# EAGLE design S2ER13 (EAGLE 7.5.0)
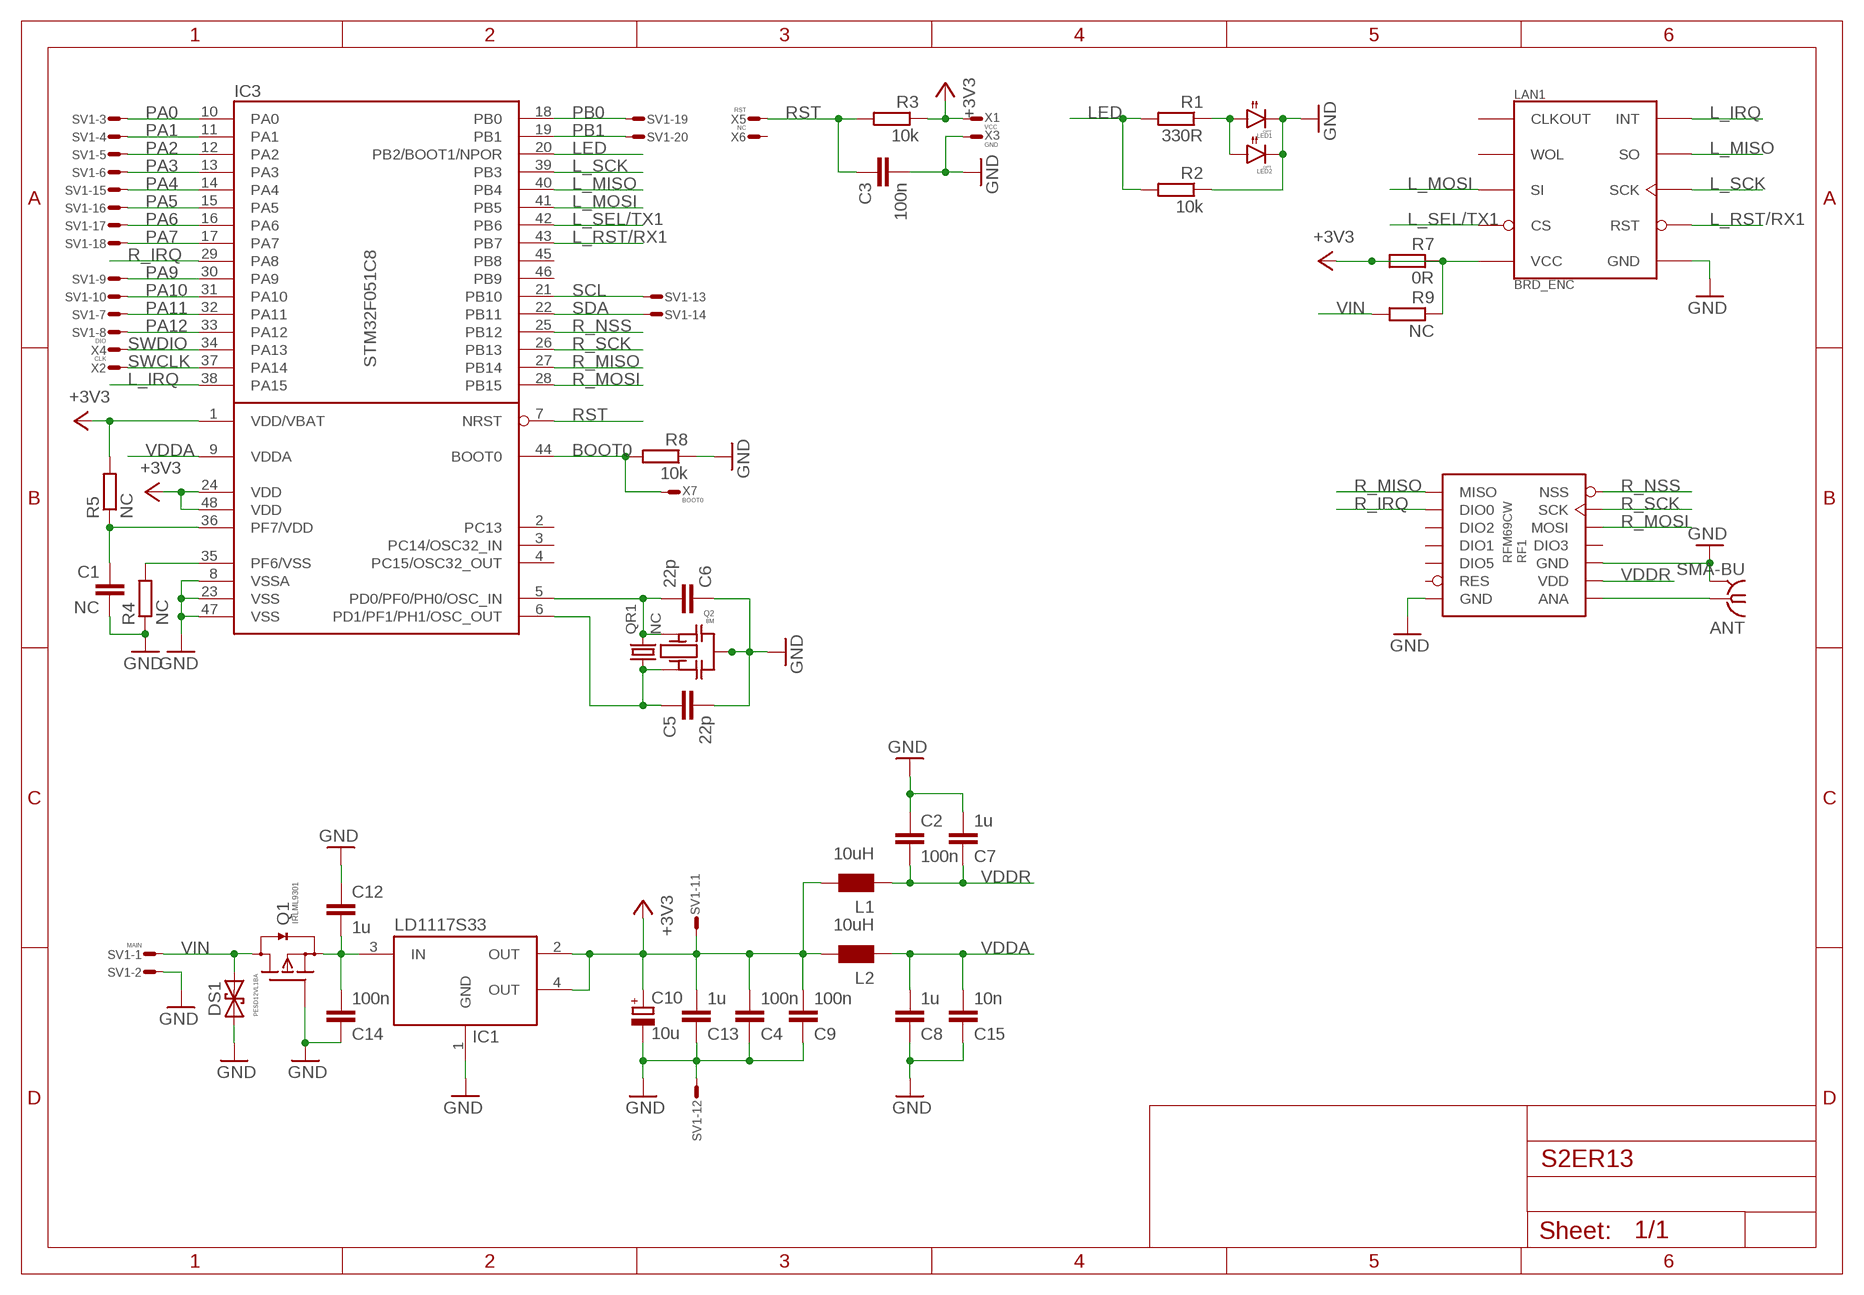
[diagram p0: schematic, sheet 1]

## Parts
ANT  SMA-BU  [BU-SMA-V]
C1  NC  C0603  [0603]
C2  100n  C0603  [0603]
C3  100n  C0603  [0603]
C4  100n  C0603  [0603]
C5  22p  C0603  [0603]
C6  22p  C0603  [0603]
C7  1u  C0603  [0603]
C8  1u  C0603  [0603]
C9  100n  C0603  [0603]
C10  10u  C_POLSMCA  [SMC_A]
C12  1u  C0603  [0603]
C13  1u  C0603  [0603]
C14  100n  C0603  [0603]
C15  10n  C0603  [0603]
DS1  PESD12VL1BA  TVS-U323  [SOD323]
IC1  LD1117S33  LDO_4P  [SOT223]
IC3  STM32F051C8  STM32_LQFP48  [LQFP48]
L1  10uH  L0603  [0603]
L2  10uH  L0603  [0603]
LAN1  BRD_ENC  [BRD_ENC]
LED1  OPT  LEDT134  [T1-3/4]
LED2  OPT  LED1206  [1206]
Q1  IRLML9301  FET-PDSOT23  [SOT23]
Q2  8M  QRCE  [CSTCE]
QR1  NC  QABS07  [ABS07]
R1  330R  R0603  [0603]
R2  10k  R0603  [0603]
R3  10k  R0603  [0603]
R4  NC  R0603  [0603]
R5  NC  R0603  [0603]
R7  0R  R0603  [0603]
R8  10k  R0603  [0603]
R9  NC  R0603  [0603]
RF1  RFM69CW  RFM69CW-868-S1  [RFM69CW]
SV1  MAIN  ML20LSE  [ML20LS]
X1  VCC  WIREPADT1.6/0.9  [T1.6/0.9]
X2  CLK  WIREPADT1.6/0.9  [T1.6/0.9]
X3  GND  WIREPADT1.6/0.9  [T1.6/0.9]
X4  DIO  WIREPADT1.6/0.9  [T1.6/0.9]
X5  RST  WIREPADT1.6/0.9  [T1.6/0.9]
X6  NC  WIREPADT1.6/0.9  [T1.6/0.9]
X7  BOOT0  WIREPADT1.6/0.9  [T1.6/0.9]

## Nets
+3V3: C4.2 C9.2 C10.+ C13.2 IC1.2(OUT) IC1.4(OUT) IC3.1(VDD/VBAT) IC3.24(VDD) IC3.48(VDD) L1.2 L2.2 LAN1.P$9(VCC) R3.1 R5.2 R7.1 R7.2 R9.1 SV1.P$11 X1.1(S)
BOOT0: IC3.44(BOOT0) R8.2 X7.1(S)
GND: ANT.2 ANT.3 ANT.4 ANT.5 C1.2 C2.1 C3.2 C4.1 C5.2 C6.1 C7.2 C8.1 C9.1 C10.- C12.1 C13.1 C14.1 C15.1 DS1.A IC1.1(GND) IC3.8(VSSA) IC3.23(VSS) IC3.47(VSS) LAN1.P$10(GND) LED1.C LED2.2(C) Q1.1(G) Q2.G(M) R2.1 R4.1 R8.1 RF1.GND@3(GND) RF1.GND@14(GND) SV1.P$2 SV1.P$12 X3.1(S)
L_IRQ: IC3.38(PA15) LAN1.P$2(INT)
L_MISO: IC3.40(PB4) LAN1.P$4(SO)
L_MOSI: IC3.41(PB5) LAN1.P$5(SI)
L_RST/RX1: IC3.43(PB7) LAN1.P$8(RST)
L_SCK: IC3.39(PB3) LAN1.P$6(SCK)
L_SEL/TX1: IC3.42(PB6) LAN1.P$7(CS)
LED: IC3.20(PB2/BOOT1/NPOR) R1.2 R2.2
N$1: LED1.A LED2.1(A) R1.1
N$2: IC3.35(PF6/VSS) R4.2
N$3: C1.1 IC3.36(PF7/VDD) R5.1
N$5: ANT.1 RF1.ANA
N$20: C6.2 IC3.5(PD0/PF0/PH0/OSC_IN) Q2.A QR1.P$2
N$21: C5.1 IC3.6(PD1/PF1/PH1/OSC_OUT) Q2.B QR1.P$1
N$31: C12.2 C14.2 IC1.3(IN) Q1.2(S)
PA0: IC3.10(PA0) SV1.P$3
PA1: IC3.11(PA1) SV1.P$4
PA2: IC3.12(PA2) SV1.P$5
PA3: IC3.13(PA3) SV1.P$6
PA4: IC3.14(PA4) SV1.P$15
PA5: IC3.15(PA5) SV1.P$16
PA6: IC3.16(PA6) SV1.P$17
PA7: IC3.17(PA7) SV1.P$18
PA9: IC3.30(PA9) SV1.P$9
PA10: IC3.31(PA10) SV1.P$10
PA11: IC3.32(PA11) SV1.P$7
PA12: IC3.33(PA12) SV1.P$8
PB0: IC3.18(PB0) SV1.P$19
PB1: IC3.19(PB1) SV1.P$20
R_IRQ: IC3.29(PA8) RF1.DIO0
R_MISO: IC3.27(PB14) RF1.MISO
R_MOSI: IC3.28(PB15) RF1.MOSI
R_NSS: IC3.25(PB12) RF1.NSS
R_SCK: IC3.26(PB13) RF1.SCK
RST: C3.1 IC3.7(NRST) R3.2 X5.1(S)
SCL: IC3.21(PB10) SV1.P$13
SDA: IC3.22(PB11) SV1.P$14
SWCLK: IC3.37(PA14) X2.1(S)
SWDIO: IC3.34(PA13) X4.1(S)
VDDA: C8.2 C15.2 IC3.9(VDDA) L2.1
VDDR: C2.2 C7.1 L1.1 RF1.VDD
VIN: DS1.C Q1.3(D) R9.2 SV1.P$1
Unconnected: IC3.2(PC13) IC3.3(PC14/OSC32_IN) IC3.4(PC15/OSC32_OUT) IC3.45(PB8) IC3.46(PB9) LAN1.P$1(CLKOUT) LAN1.P$3(WOL) RF1./RES(RES) RF1.DIO1 RF1.DIO2 RF1.DIO3 RF1.DIO5 X6.1(S)

## Library data of the parts
ANT = Conn:SMA-: SMA 50 Ohm End Launch Jack Receptacle - Round Contact Johnson Components Source: www.johnsoncomponents.com .. J502-ND.pdf
C1-C9 C12-C15 = RCL:C: Capacitor SMD
C10 = RCL:C_POL: POLARIZED CAPACITOR, European symbol
DS1 = Diode:TVS-U: DIODE
IC1 = DCDC:LDO_4P
IC3 = STM32:STM32_LQFP48
L1 L2 = RCL:L
LAN1 = brd_enc:BRD_ENC
LED1 LED2 = Optic:LED
Q1 = Transistor:FET-PD
Q2 = QUARTZ:QR
QR1 = QUARTZ:Q
R1-R5 R7-R9 = RCL:R: Resistor SMD
RF1 = RF:RFM69CW: 5dB Transceiver Module
SV1 = Conn:ML20?E: HARTING
X1-X7 = Conn:WIREPAD: Wire PAD connect wire on PCB

## Board
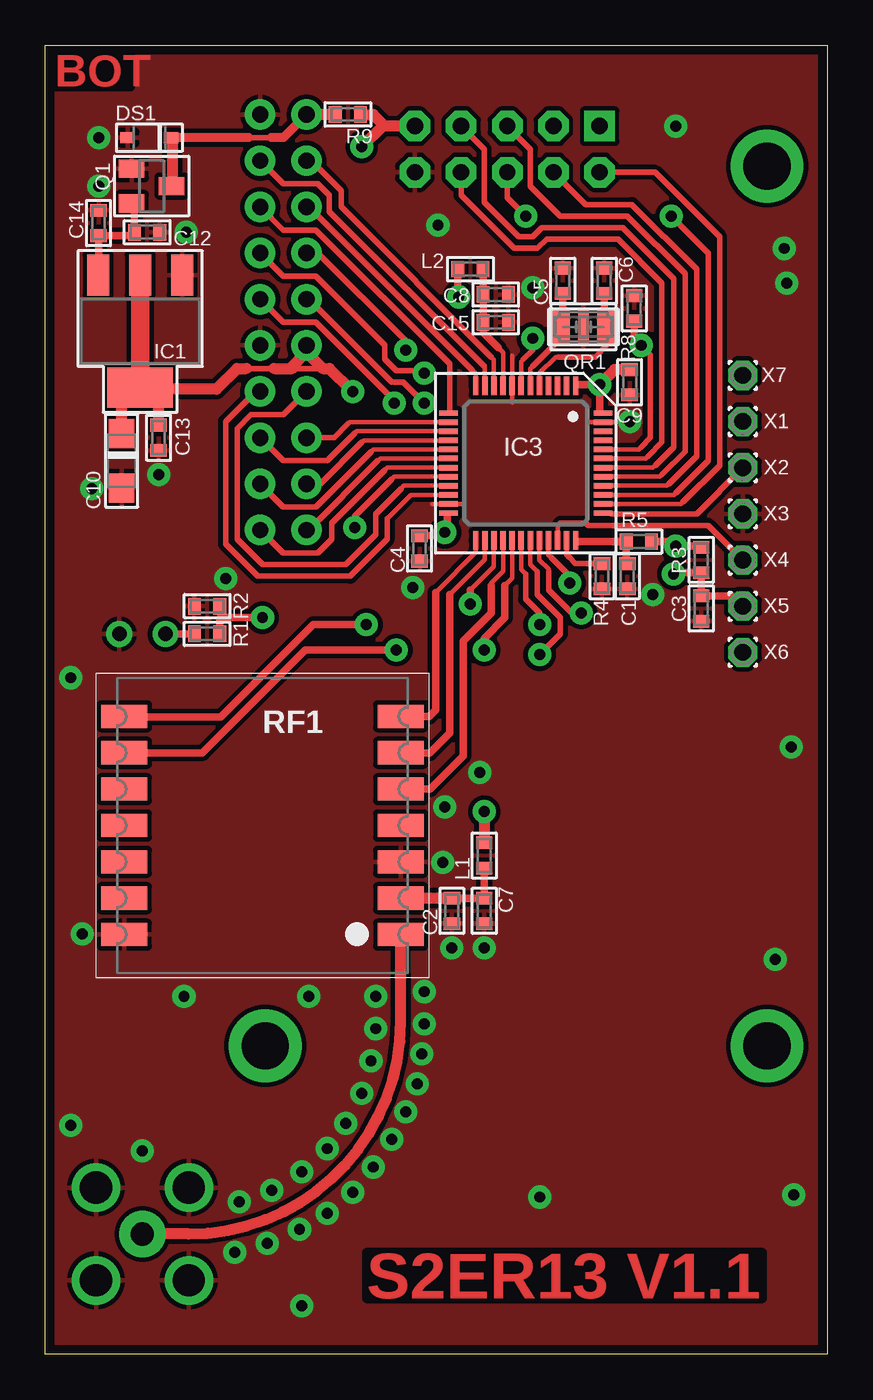
[diagram p1: board, top side]
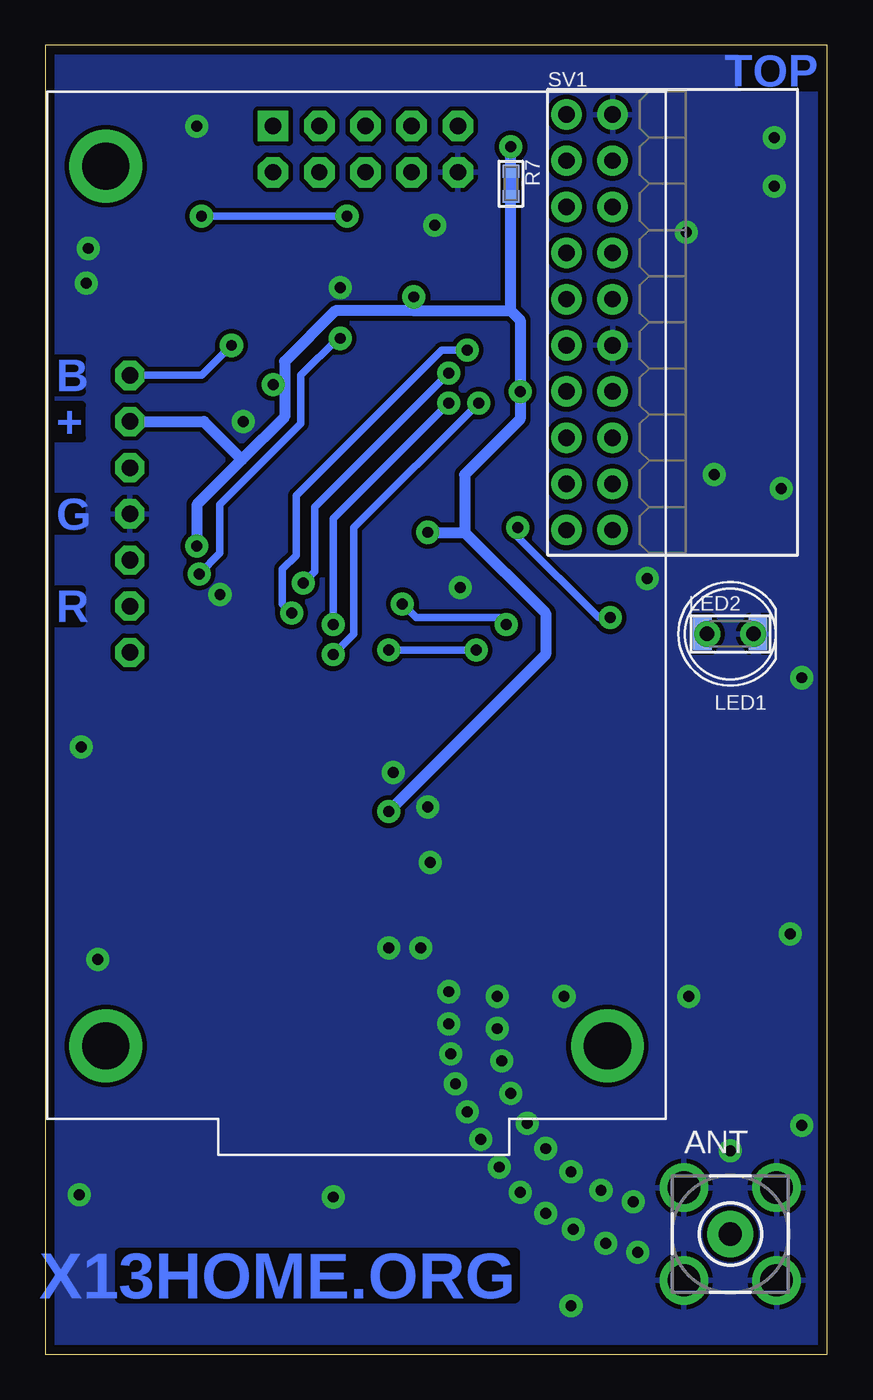
[diagram p2: board, bottom side, seen from below]

Size 43 x 72 mm. Coordinates in mm from the lower left corner, seen from the top.
Outline: 43,0 0,0 0,72 43,72 43,0
Copper layers (1*16): Top 0.035mm / dielectric 1.5mm / Bottom 0.035mm
Design rules "default *": minimum track width 10mil, minimum drill 0.5mm, track to track 10mil, track to pad 10mil, pad to pad 6mil, via to via 10mil, smd to smd 6mil, copper to edge 20mil, drill to drill 8mil, minimum pad ring 10mil, minimum via ring 8mil, stop-mask expansion 2mil, vias tented up to drill 25mil, thermal gap 10mil
tKeepout: area 0,0 to 43,2.5; area 0,69.5 to 43,72
bKeepout: area 0,0 to 43,1.3; area 0,70.7 to 43,72

### Footprints (pad centres in the part's own frame; a part is rotated, then mirrored left to right if it is on the bottom)
BU-SMA-V = drill 1.27 pad 2.54: 1 0,0 | drill 1.778: 2 -2.55,2.55; 3 2.55,2.55; 4 2.55,-2.55; 5 -2.55,-2.55
0603 = smd 0.7 x 0.9: 1 -0.697,0; 2 0.697,0
SMC_A = smd 1.6 x 1.4: + -1.5,0; - 1.5,0
SOD323 = smd 0.8 x 0.6: A 1.2,0; C -1.2,0
SOT223 = smd 1.219 x 2.235: 1 -2.311,-3.099; 2 0,-3.099; 3 2.311,-3.099 | smd 3.6 x 2.2: 4 0,3.099
LQFP48 = smd 0.3 x 1: 1 -2.75,-4.25; 2 -2.25,-4.25; 3 -1.75,-4.25; 4 -1.25,-4.25; 5 -0.75,-4.25; 6 -0.25,-4.25; 7 0.25,-4.25; 8 0.75,-4.25; 9 1.25,-4.25; 10 1.75,-4.25; 11 2.25,-4.25; 12 2.75,-4.25; 25 2.75,4.25; 26 2.25,4.25; 27 1.75,4.25; 28 1.25,4.25; 29 0.75,4.25; 30 0.25,4.25; 31 -0.25,4.25; 32 -0.75,4.25; 33 -1.25,4.25; 34 -1.75,4.25; 35 -2.25,4.25; 36 -2.75,4.25 | smd 1 x 0.3: 13 4.25,-2.75; 14 4.25,-2.25; 15 4.25,-1.75; 16 4.25,-1.25; 17 4.25,-0.75; 18 4.25,-0.25; 19 4.25,0.25; 20 4.25,0.75; 21 4.25,1.25; 22 4.25,1.75; 23 4.25,2.25; 24 4.25,2.75; 37 -4.25,2.75; 38 -4.25,2.25; 39 -4.25,1.75; 40 -4.25,1.25; 41 -4.25,0.75; 42 -4.25,0.25; 43 -4.25,-0.25; 44 -4.25,-0.75; 45 -4.25,-1.25; 46 -4.25,-1.75; 47 -4.25,-2.25; 48 -4.25,-2.75
BRD_ENC = drill 0.9 pad 1.676 square: P$1 21.59,54.61 | drill 0.9 pad 1.676 octagon: P$2 21.59,52.07; P$3 19.05,54.61; P$4 19.05,52.07; P$5 16.51,54.61; P$6 16.51,52.07; P$7 13.97,54.61; P$8 13.97,52.07; P$9 11.43,54.61; P$10 11.43,52.07 | drill 2.6 pad 4: PAD@1 3.2,4; PAD@2 30.8,4; PAD@3 30.8,52.4
T1-3/4 = drill 0.8 pad 1.422: A 1.27,0; C -1.27,0
1206 = smd 1.016 x 1.778: 1 -1.524,0; 2 1.524,0
SOT23 = smd 1 x 1.4: 1 -0.95,-1.1; 2 0.95,-1.1; 3 0,1.1
CSTCE = smd 0.6 x 2: A -1.2,0; B 1.2,0; G 0,0
ABS07 = smd 1 x 1.8: P$1 -1.25,0; P$2 1.25,0
RFM69CW = smd 2.54 x 1.27: /RES -7.6,-4; ANA 7.6,-6; DIO0 -7.6,4; DIO1 -7.6,0; DIO2 -7.6,2; DIO3 7.6,0; DIO5 -7.6,-2; GND@3 7.6,-2; GND@14 -7.6,-6; MISO -7.6,6; MOSI 7.6,2; NSS 7.6,6; SCK 7.6,4; VDD 7.6,-4
ML20LS = drill 0.9 pad 1.676: P$1 -11.43,-1.27; P$2 -11.43,1.27; P$3 -8.89,-1.27; P$4 -8.89,1.27; P$5 -6.35,-1.27; P$6 -6.35,1.27; P$7 -3.81,-1.27; P$8 -3.81,1.27; P$9 -1.27,-1.27; P$10 -1.27,1.27; P$11 1.27,-1.27; P$12 1.27,1.27; P$13 3.81,-1.27; P$14 3.81,1.27; P$15 6.35,-1.27; P$16 6.35,1.27; P$17 8.89,-1.27; P$18 8.89,1.27; P$19 11.43,-1.27; P$20 11.43,1.27
T1.6/0.9 = drill 0.914 pad 1.6 octagon: 1 0,0

### Placement (x,y rotation side)
ANT  5.33,6.6 0 bottom
C1  32,42.8 270 top
C2  22.35,24.38 90 top
C3  36.07,41.02 270 top
C4  20.57,44.32 90 top
C5  28.45,59.05 90 top
C6  30.73,59.05 270 top
C7  24.13,24.38 270 top
C8  24.77,58.29 180 top
C9  32.13,53.47 90 top
C10  4.19,49.15 270 top
C12  5.59,61.72 180 top
C13  6.22,50.42 90 top
C14  2.92,62.23 270 top
C15  24.77,56.77 180 top
DS1  5.71,66.93 180 top
IC1  5.21,56.26 180 top
IC3  26.42,49.02 180 top
L1  24.13,27.43 90 top
L2  23.37,59.69 180 top
LAN1  8.89,12.95 0 top
LED1  5.33,39.62 180 bottom
LED2  5.33,39.62 0 bottom
Q1  5.84,64.26 270 top
Q2  29.59,56.52 180 top
QR1  29.59,56.52 0 top
R1  8.89,39.62 0 top
R2  8.89,41.15 0 top
R3  36.07,43.69 270 top
R4  30.61,42.8 90 top
R5  32.64,44.7 0 top
R7  17.4,64.39 270 bottom
R8  32.38,57.53 270 top
R9  16.64,68.2 180 top
RF1  11.94,29.08 0 top
SV1  13.08,56.77 270 bottom
X1  38.35,51.31 0 top
X2  38.35,48.77 0 top
X3  38.35,46.23 0 top
X4  38.35,43.69 0 top
X5  38.35,41.15 0 top
X6  38.35,38.61 0 top
X7  38.35,53.85 0 top

### Tracks (layer width: path | path; a pad name or v marks a point on that pad's centre or on a via)
+3V3  (via drill 0.6 pad 1.27)
  Top 0.254: IC3.1 29.27,53.27 | IC3.24 22.17,46.17 22.1,46.1 | IC3.48 30.65,51.77 30.48,51.94
  Top 0.305: 29.27,53.27 29.34,53.34 | 11.05,54.23 12.57,54.23 | 13.59,54.23 15.24,54.23 | 32.32,54.36 C9.2
  Top 0.406: 29.34,53.34 v30.48,53.34 30.48,51.94 | C4.2 21.78,45.02 v21.97,45.21 22.1,45.34 22.1,46.1 | v22.73,58.17 22.67,58.23 L2.2 | R5.2 34.42,44.7 v34.67,44.45 36,44.45 R3.1
  Top 0.61: 6.1,53.09 9.4,53.09 10.54,54.23 11.05,54.23 | 6.1,53.09 5.28,53.09 IC1.4 5.13,53.09 4.19,53.09 C10.+ | v16.89,52.96 15.62,54.23 15.24,54.23 14.35,55.12 | LAN1.P$9 18.67,67.56 | 18.67,67.56 18.54,67.56 v17.4,66.42 | C13.2 6.22,52.96 6.1,53.09 | R9.1 18.03,68.2 18.67,67.56 | 12.57,54.23 13.46,54.23 | 13.46,54.23 13.59,54.23 | SV1.P$11 14.35,55.12 | 14.35,55.12 13.46,54.23 | v30.48,53.34 31.3,54.16 C9.2 | v24.13,29.84 L1.2
  Top 1.016: IC1.2 IC1.4
  Bottom 0.61: 19.94,45.21 19.94,48.39 16.89,51.44 v16.89,52.96 16.89,56.9 17.4,57.4 | v21.97,45.21 19.94,45.21 | 22.73,57.4 17.4,57.4 | 17.4,57.4 R7.2 R7.1 v17.4,66.42 | v22.73,58.17 22.73,57.4 | 29.84,53.34 29.84,54.61 27.05,57.4 22.73,57.4 | 29.84,53.34 29.84,51.56 32.19,49.21 | 32.19,49.21 34.67,46.74 v34.67,44.45 | X1.1 34.29,51.31 32.19,49.21 | v30.48,53.34 29.84,53.34 | 19.94,45.21 15.49,40.77 15.49,38.48 v24.13,29.84
BOOT0  (via drill 0.6 pad 1.27)
  Top 0.254: IC3.44 32.63,49.77 32.77,49.91
  Top 0.305: 32.77,49.91 33.27,50.42 33.27,54.99 v32.77,55.5
  Top 0.406: R8.2 32.38,55.88 v32.77,55.5
  Bottom 0.406: X7.1 34.42,53.85 v32.77,55.5
GND  (via drill 0.6 pad 1.27)
  Top 0.254: 25.67,52.34 IC3.8 25.67,54.92 | IC3.47 31.41,51.27 | 29.9,51.27 30.64,51.27 | 22.95,46.77 IC3.23 21.28,46.77
  other vias: 2.92,66.93 32.13,51.31 26.8,58.67 40.64,60.83 7.75,61.72 6.22,48.39 20.19,42.16 33.4,41.78 34.67,67.56 21.59,62.1 9.91,42.67 2.54,47.62 2.92,64.26 21.84,27.05 2.03,23.11 22.35,22.35 24.13,22.35 40.77,58.93 41.02,33.4 40.13,21.72 41.15,8.76 1.4,37.21 1.4,12.57 14.1,2.67 27.18,8.64 18.16,19.68 18.16,17.91 17.91,16.13 17.4,14.35 16.51,12.7 15.49,11.3 14.1,10.03 12.45,9.02 10.67,8.38 5.33,11.18 10.41,5.59 12.19,6.1 13.97,6.86 15.49,7.75 16.89,8.89 18.03,10.29 19.05,11.81 19.81,13.34 20.45,14.86 20.7,16.51 20.83,18.16 20.83,19.94 7.62,19.68 14.48,19.68 21.97,30.1 23.88,32
  pour Bottom: 43,0 0,0 0,72 43,72
  pour Top: 43,0 0,0 0,72 43,72
L_IRQ
  Top 0.254: IC3.38 34.96,46.77 35.05,46.86
  Top 0.305: LAN1.P$2 33.53,65.02 37.08,61.47 37.08,48.9 35.05,46.86
L_MISO
  Top 0.254: IC3.40 34.18,47.77 34.29,47.88
  Top 0.305: 34.29,47.88 35.81,49.4 35.81,59.69 32.26,63.25 29.72,63.25 LAN1.P$4
L_MOSI
  Top 0.254: IC3.41 33.79,48.27 33.91,48.39
  Top 0.305: LAN1.P$5 26.67,66.29 26.67,64.26 28.32,62.61 32,62.61 35.18,59.44 35.18,49.66 33.91,48.39
L_RST/RX1
  Top 0.254: IC3.43 33.02,49.27 33.15,49.4
  Top 0.305: 22.86,64.9 LAN1.P$8 22.86,63.75 25.78,60.83 27.05,60.83 27.56,61.34 31.5,61.34 33.91,58.93 33.91,50.16 33.15,49.4
L_SCK  (via drill 0.6 pad 1.27)
  Top 0.254: IC3.39 34.57,47.27 34.67,47.37
  Top 0.305: LAN1.P$6 25.4,63.63 v26.42,62.61 | 34.67,47.37 36.45,49.15 36.45,60.58 v34.42,62.61
  Bottom 0.406: v34.42,62.61 v26.42,62.61
L_SEL/TX1
  Top 0.254: IC3.42 33.41,48.77 33.53,48.9
  Top 0.305: LAN1.P$7 24.13,66.29 24.13,63.37 26.04,61.47 26.8,61.47 27.3,61.98 31.75,61.98 34.54,59.18 34.54,49.91 33.53,48.9
LED  (via drill 0.6 pad 1.27)
  Top 0.254: IC3.20 19.19,48.27 19.05,48.13
  Top 0.305: 19.05,48.13 17.02,46.1 v17.02,45.47
  Top 0.406: v11.94,40.51 9.65,40.51 | 9.65,40.51 9.65,41.08 R2.2 | R1.2 9.59,40.45 9.65,40.51
  Bottom 0.406: v17.02,45.47 17.02,44.96 12.57,40.51 v11.94,40.51
N$1
  Top 0.406: R1.1 LED1.A
  Bottom 0.406: LED2.1 LED1.A
N$2
  Top 0.254: IC3.35 28.67,43.98
  Top 0.305: 28.67,43.98 28.83,43.81 29.15,43.5 R4.2
N$3
  Top 0.254: IC3.36 29.27,44.77
  Top 0.305: 29.27,44.77 29.34,44.7
  Top 0.406: C1.1 31.94,43.56 R5.1 29.34,44.7
N$5
  Top 0.61: ANT.1 7.87,6.6 arc90 19.54,18.27 RF1.ANA
N$20
  Top 0.254: IC3.5 27.17,53.96 28.07,54.86 28.19,54.86
  Top 0.305: 28.19,54.86 30.23,54.86 30.84,55.48 QR1.P$2 | 30.73,56.46 Q2.A
  Top 0.406: C6.2 30.73,56.62 QR1.P$2
  Top 0.61: Q2.A QR1.P$2
N$21
  Top 0.254: IC3.6 26.67,54.23 26.8,54.36
  Top 0.305: 28.32,56.39 28.32,56.49 QR1.P$1 | 26.8,54.36 28.39,55.95 Q2.B
  Top 0.406: C5.1 28.45,56.57 Q2.B
  Top 0.61: Q2.B QR1.P$1
N$31
  Top 0.406: IC1.3 2.92,59.38 C14.2 4.7,61.53 C12.2 4.89,63.16 Q1.2
PA0
  Top 0.254: IC3.10 24.67,54.71 24.51,54.86
  Top 0.305: 24.51,54.86 16.26,63.12 16.26,64.01 14.61,65.66 SV1.P$3
PA1
  Top 0.254: IC3.11 24.17,54.32 24.13,54.36
  Top 0.305: 24.13,54.36 15.62,62.87 15.62,63.75 14.99,64.39 13.08,64.39 SV1.P$4
PA2
  Top 0.254: IC3.12 23.67,53.93 23.56,54.04
  Top 0.305: 23.56,54.04 23.44,54.16 14.48,63.12 SV1.P$5
PA3
  Top 0.254: IC3.13 22.18,51.77 22.23,51.82
  Top 0.305: SV1.P$6 13.08,61.85 14.86,61.85 22.23,54.48 22.23,51.82
PA4
  Top 0.254: IC3.14 16.73,51.27 16.64,51.18
  Top 0.305: SV1.P$15 15.88,50.42 16.64,51.18
PA5
  Top 0.254: IC3.15 17.12,50.77 17.02,50.67
  Top 0.305: 17.02,50.67 15.49,49.15 13.08,49.15 SV1.P$16
PA6
  Top 0.254: IC3.16 17.51,50.27 17.4,50.16
  Top 0.305: 17.4,50.16 15.11,47.88 SV1.P$17
PA7
  Top 0.254: IC3.17 18.02,49.77 17.91,49.66
  Top 0.305: SV1.P$18 13.08,46.61 14.86,46.61 17.91,49.66
PA9  (via drill 0.6 pad 1.27)
  Top 0.254: IC3.30 26.17,43.18 26.42,42.93
  Top 0.305: v27.18,40.13 27.18,40.77 26.42,41.53 26.42,42.93 | SV1.P$9 14.48,58.04 19.05,53.47 19.68,53.47 v20.83,52.32
  Bottom 0.406: v20.83,52.32 27.18,45.97 v27.18,40.13
PA10  (via drill 0.6 pad 1.27)
  Top 0.254: IC3.31 26.67,43.44 27.05,43.05
  Top 0.305: SV1.P$10 13.08,56.77 14.86,56.77 19.18,52.45 v19.18,52.32 | 27.05,43.05 27.05,41.78 28.32,40.51 28.32,39.62 v27.18,38.48
  Bottom 0.406: v19.18,52.32 26.04,45.47 26.04,39.62 v27.18,38.48
PA11  (via drill 0.6 pad 1.27)
  Top 0.254: IC3.32 27.17,43.7 27.69,43.18 27.69,43.05
  Top 0.305: v19.81,55.24 19.81,55.75 14.99,60.58 SV1.P$7 | 27.69,43.05 27.69,42.04 28.96,40.77 v29.46,40.77
  Bottom 0.406: v19.81,55.24 21.21,55.24 29.21,47.24 29.21,43.94 29.97,43.18 29.97,41.27 v29.46,40.77
PA12  (via drill 0.6 pad 1.27)
  Top 0.254: IC3.33 27.67,43.96 27.81,43.81
  Top 0.305: SV1.P$8 13.08,59.31 14.86,59.31 18.67,55.5 18.67,54.74 19.3,54.1 20.7,54.1 v20.83,53.98 | 27.81,43.81 28.83,42.8 v28.83,42.42
  Bottom 0.406: v20.83,53.98 28.19,46.61 28.19,43.05 v28.83,42.42
PB0
  Top 0.254: IC3.18 18.41,49.27 18.29,49.15
  Top 0.305: 18.29,49.15 14.48,45.34 SV1.P$19
PB1
  Top 0.254: IC3.19 18.8,48.77 18.67,48.64
  Top 0.305: 18.67,48.64 15.75,45.72 15.75,44.83 14.99,44.07 13.08,44.07 SV1.P$20
R_IRQ  (via drill 0.6 pad 1.27)
  Top 0.254: IC3.29 25.67,42.68 25.27,42.29
  Top 0.406: RF1.DIO0 8.64,33.08 14.29,38.73 v19.3,38.73 | 25.27,42.29 25.27,40.51 24.13,39.37 v24.13,38.73
  Bottom 0.406: v24.13,38.73 v19.3,38.73
R_MISO  (via drill 0.6 pad 1.27)
  Top 0.254: IC3.27 24.67,43.34 23.37,42.04
  Top 0.406: 23.37,42.04 v23.37,41.27 | 4.45,35.05 4.41,35.08 RF1.MISO 4.37,35.05 9.65,35.05 14.73,40.13 v17.65,40.13
  Bottom 0.406: v17.65,40.13 18.03,40.51 22.61,40.51 v23.37,41.27
R_MOSI
  Top 0.254: IC3.28 25.17,43.07 24.51,42.42 24.51,42.29
  Top 0.406: RF1.MOSI 21.18,31.08 22.99,32.89 22.99,39.24 24.51,40.77 24.51,42.29
R_NSS
  Top 0.254: IC3.25 23.67,44.11 21.46,41.91
  Top 0.406: 21.46,41.91 21.46,35.43 21.11,35.08 RF1.NSS
R_SCK
  Top 0.254: IC3.26 24.17,43.72 22.23,41.78
  Top 0.406: 22.23,41.78 22.23,34.16 21.14,33.08 RF1.SCK
RST  (via drill 0.6 pad 1.27)
  Top 0.254: IC3.7 26.17,54.61 26.29,54.74
  Top 0.305: 26.29,54.74 26.8,55.24 v26.8,55.88
  Top 0.406: X5.1 37.78,41.72 C3.1 R3.2 34.61,42.99 v34.54,42.93
  Bottom 0.406: v34.54,42.93 33.4,44.07 33.4,46.74 28.96,51.18 28.96,53.85 26.92,55.88 v26.8,55.88
SCL
  Top 0.254: IC3.21 19.7,47.77 19.56,47.62
  Top 0.305: 19.56,47.62 18.16,46.23 18.16,45.09 16.51,43.43 11.94,43.43 10.54,44.83 10.54,50.93 11.3,51.69 13.08,51.69 SV1.P$13
SDA
  Top 0.254: IC3.22 20.09,47.27 18.8,45.97
  Top 0.305: 18.8,45.97 18.8,44.83 16.76,42.8 11.68,42.8 9.91,44.58 9.91,51.31 11.56,52.96 SV1.P$14
SWCLK
  Top 0.254: IC3.37 31.07,46.27 31.11,46.23
  Top 0.305: 31.11,46.23 35.81,46.23 X2.1
SWDIO
  Top 0.254: IC3.34 28.17,45.56 28.32,45.72
  Top 0.305: 28.32,45.72 29.72,45.72 29.84,45.59 36.45,45.59 X4.1
VDDA
  Top 0.254: IC3.9 25.17,55.1 24.89,55.37
  Top 0.406: 24.89,55.37 24.07,56.2 C15.2 C8.2 L2.1
VDDR
  Top 0.406: C2.2 C7.1 L1.1
  Top 0.61: RF1.VDD C2.2
VIN
  Top 0.305: 12.45,66.93 11.18,66.93
  Top 0.406: 6.92,64.29 Q1.3 | DS1.C 6.92,66.75 6.99,66.67
  Top 0.508: SV1.P$1 13.08,66.93 12.45,66.93 | 11.18,66.93 DS1.C
  Top 0.61: R9.2 SV1.P$1 | 6.99,66.67 6.99,64.31 Q1.3

### Text on the board
Top: BOT | S2ER13 V1.1
Bottom: TOP | B | + | G | R | X13HOME.ORG